# Altium schematic sheet FB.SchDoc
size A4; SheetNumber: 2; SheetTotal: 3
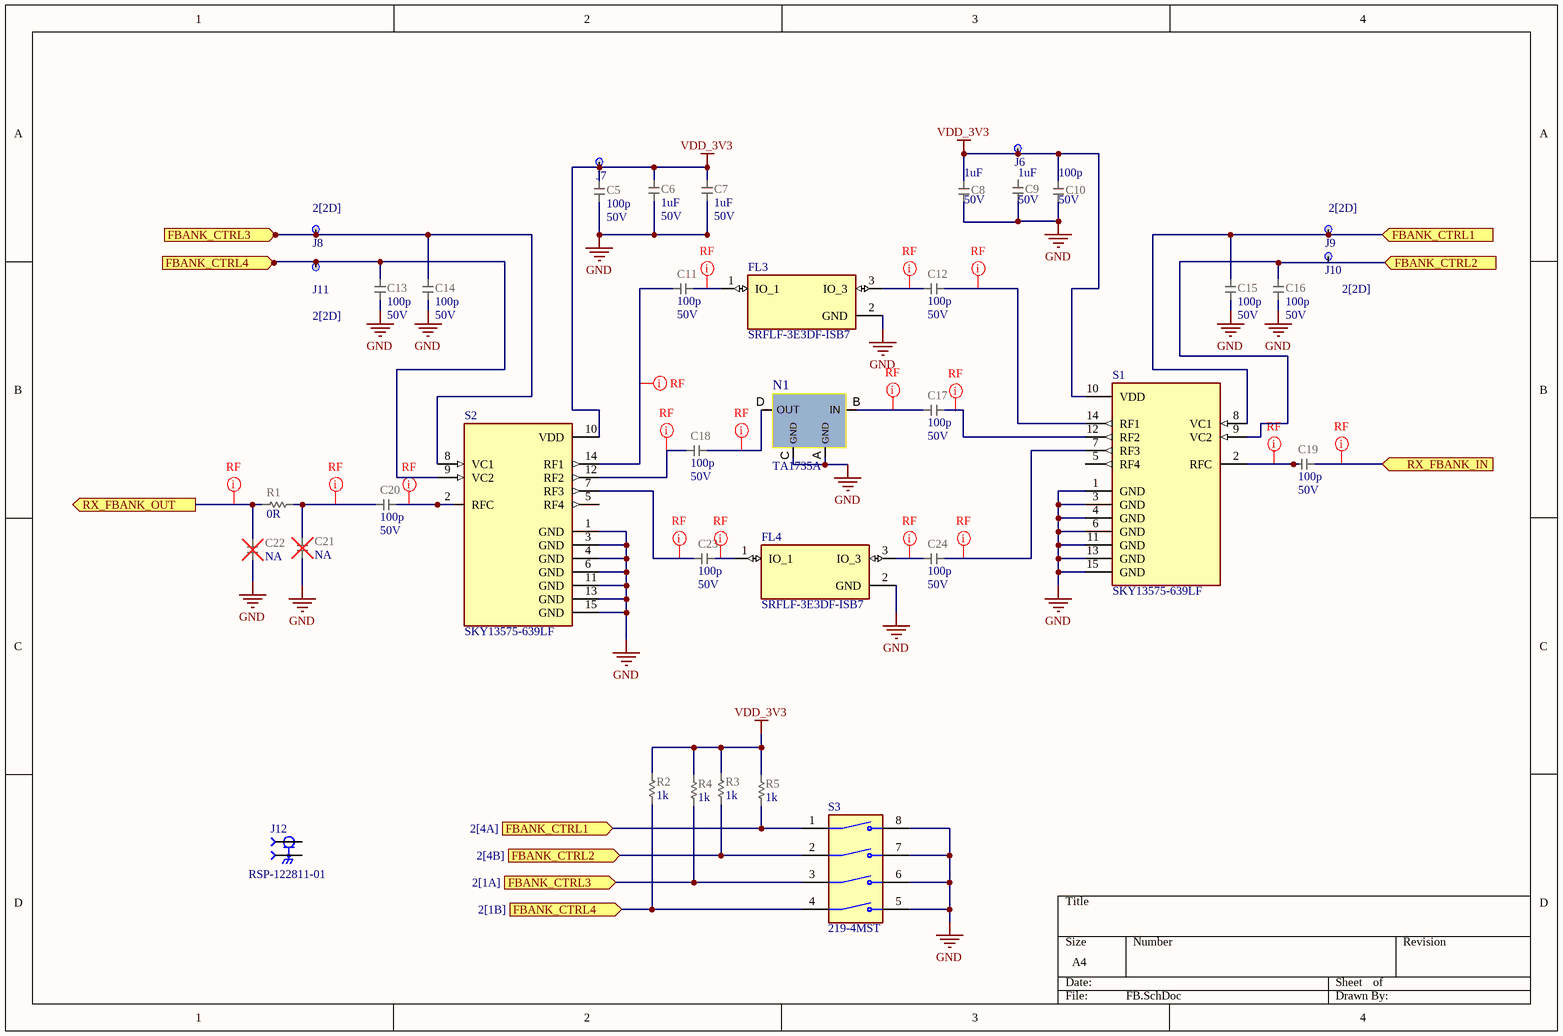
[diagram p0: FB.SchDoc]

## Parts
C5  value 100p  Voltage: 50V  [CAP_0603_UN1Q]  (hidden comment: CAP_0603_100p)
C6  value 1uF  Voltage: 50V  [CAP_0603_UN1Q]  (hidden comment: CAP_0603_1u_X7R)
C7  value 1uF  Voltage: 50V  [CAP_0603_UN1Q]  (hidden comment: CAP_0603_1u_X7R)
C8  value 1uF  Voltage: 50V  [CAP_0603_UN1Q]  (hidden comment: CAP_0603_1u_X7R)
C9  value 1uF  Voltage: 50V  [CAP_0603_UN1Q]  (hidden comment: CAP_0603_1u_X7R)
C10  value 100p  Voltage: 50V  [CAP_0603_UN1Q]  (hidden comment: CAP_0603_100p)
C11  value 100p  Voltage: 50V  [CAP_0603_UN1Q]  (hidden comment: CAP_0603_100p)
C12  value 100p  Voltage: 50V  [CAP_0603_UN1Q]  (hidden comment: CAP_0603_100p)
C13  value 100p  Voltage: 50V  [CAP_0603_UN1Q]  (hidden comment: CAP_0603_100p)
C14  value 100p  Voltage: 50V  [CAP_0603_UN1Q]  (hidden comment: CAP_0603_100p)
C15  value 100p  Voltage: 50V  [CAP_0603_UN1Q]  (hidden comment: CAP_0603_100p)
C16  value 100p  Voltage: 50V  [CAP_0603_UN1Q]  (hidden comment: CAP_0603_100p)
C17  value 100p  Voltage: 50V  [CAP_0603_UN1Q]  (hidden comment: CAP_0603_100p)
C18  value 100p  Voltage: 50V  [CAP_0603_UN1Q]  (hidden comment: CAP_0603_100p)
C19  value 100p  Voltage: 50V  [CAP_0603_UN1Q]  (hidden comment: CAP_0603_100p)
C20  value 100p  Voltage: 50V  [CAP_0603_UN1Q]  (hidden comment: CAP_0603_100p)
C21  value NA  [CAP_0603_UN1Q]  (hidden comment: CAP_0603_NA)
C22  value NA  [CAP_0603_UN1Q]  (hidden comment: CAP_0603_NA)
C23  value 100p  Voltage: 50V  [CAP_0603_UN1Q]  (hidden comment: CAP_0603_100p)
C24  value 100p  Voltage: 50V  [CAP_0603_UN1Q]  (hidden comment: CAP_0603_100p)
FL3  SRFLF-3E3DF-ISB7  [FIL_SRFLF-3E3DF-ISB7]
FL4  SRFLF-3E3DF-ISB7  [FIL_SRFLF-3E3DF-ISB7]
J6  Testpoint, Surface, 1.0mm  [TP_1mm_UN1Q]  (value not drawn)  (no BOM)
J7  Testpoint, Surface, 1.0mm  [TP_1mm_UN1Q]  (value not drawn)  (no BOM)
J8  Testpoint, Surface, 1.0mm  [TP_1mm_UN1Q]  (value not drawn)  (no BOM)
J9  Testpoint, Surface, 1.0mm  [TP_1mm_UN1Q]  (value not drawn)  (no BOM)
J10  Testpoint, Surface, 1.0mm  [TP_1mm_UN1Q]  (value not drawn)  (no BOM)
J11  Testpoint, Surface, 1.0mm  [TP_1mm_UN1Q]  (value not drawn)  (no BOM)
J12  RSP-122811-01  [SAMTEC_RSP-122811-01]
N1  TA1735A  [TA1735A_SM2016-4]
R1  value 0R  [RES_0603_UN1Q]  (hidden comment: RES_0603_0R)
R2  value 1k  [RES_0603_UN1Q]  (hidden comment: RES_0603_1k)
R3  value 1k  [RES_0603_UN1Q]  (hidden comment: RES_0603_1k)
R4  value 1k  [RES_0603_UN1Q]  (hidden comment: RES_0603_1k)
R5  value 1k  [RES_0603_UN1Q]  (hidden comment: RES_0603_1k)
S1  SKY13575-639LF  [SW_SKY13575-639LF]
S2  SKY13575-639LF  [SW_SKY13575-639LF]
S3  219-4MST  [SW_219-4MST]

## Ports
FBANK_CTRL1 (in, see 2[2D]), FBANK_CTRL1 (in, see 2[4A]), FBANK_CTRL2 (in, see 2[2D]), FBANK_CTRL2 (in, see 2[4B]), FBANK_CTRL3 (in, see 2[1A]), FBANK_CTRL3 (in, see 2[2D]), FBANK_CTRL4 (in, see 2[1B]), FBANK_CTRL4 (in, see 2[2D]), RX_FBANK_IN (in), RX_FBANK_OUT (out)

## Nets
GND: C5.2 C6.1 C7.1 C8.1 C9.1 C10.2 C13.2 C14.2 C15.2 C16.2 C21.1 C22.1 FL3.2(GND) FL4.2(GND) N1.A(GND) N1.C(GND) S1.1(GND) S1.3(GND) S1.4(GND) S1.6(GND) S1.11(GND) S1.13(GND) S1.15(GND) S2.1(GND) S2.3(GND) S2.4(GND) S2.6(GND) S2.11(GND) S2.13(GND) S2.15(GND) S3.5 S3.6 S3.7 S3.8
VDD_3V3: C5.1 C6.2 C7.2 C8.2 C10.1 J6.1(TP) J7.1(TP) R2.2 R3.2 R4.2 R5.2 S1.10(VDD) S2.10(VDD)
FBANK_CTRL1: C15.1 J9.1(TP) R5.1 S1.8(VC1) S3.1 ; port FBANK_CTRL1
FBANK_CTRL2: C16.1 R3.1 S1.9(VC2) S3.2 ; port FBANK_CTRL2
FBANK_CTRL3: C14.1 J8.1(TP) R4.1 S2.8(VC1) S3.3 ; port FBANK_CTRL3
FBANK_CTRL4: C13.1 J11.1(TP) R2.1 S2.9(VC2) S3.4 ; port FBANK_CTRL4
RX_FBANK_IN: C19.1 ; port RX_FBANK_IN
RX_FBANK_OUT: C22.2 R1.1 ; port RX_FBANK_OUT
NetC11_1: C11.1 FL3.1(IO_1)
NetC11_2: C11.2 S2.14(RF1)
NetC12_1: C12.1 S1.14(RF1)
NetC12_2: C12.2 FL3.3(IO_3)
NetC17_1: C17.1 S1.12(RF2)
NetC17_2: C17.2 N1.B(IN)
NetC18_1: C18.1 N1.D(OUT)
NetC18_2: C18.2 S2.12(RF2)
NetC19_2: C19.2 S1.2(RFC)
NetC20_1: C20.1 S2.2(RFC)
NetC20_2: C20.2 C21.2 R1.2
NetC23_1: C23.1 FL4.1(IO_1)
NetC23_2: C23.2 S2.7(RF3)
NetC24_1: C24.1 S1.7(RF3)
NetC24_2: C24.2 FL4.3(IO_3)
NetJ12_G1: J12.G1(GND) J12.G2(GND)

Not connected (* = marked no-connect by the designer): C9 2; J10 1(TP); J12 1; S1 5(RF4); S2 5(RF4)

## Layout directives
net class RF: (no net found under the mark), NetC11_1, NetC11_2, NetC12_1, NetC12_2, NetC17_2, NetC18_1, NetC18_2, NetC19_2, NetC20_1, NetC20_2, NetC23_1, NetC23_2, NetC24_1, NetC24_2, RX_FBANK_IN, RX_FBANK_OUT

## Library data of the parts
C5 C10-C20 C23 C24 = CMP-001-000378-11: CAP; Manufacturer: Murata; Part Number: GCM188R71H102KA37J; Temperature characteristics: X7R; HasBeenBuilt: TBD; System: RLC; Alternative component: Allowed; Sort order: 306; Tolerance: +/-10%; Creation date: 20210927; Package: 0603; ComponentLink4Description: 4_X-information; ComponentLink2Description: 2_Product page; ECCN: EAR99; RoHS: RoHS3; Operating temperature range: -55 ... +125°C; ComponentLink3Description: 3_X-information; Source: RLC_UN1Q.SchLib; ComponentLink1Description: 1_Datasheet; Manufacturer Part Number: GCM188R71H102KA37J; Component Type: Capacitor
C6-C9 = CMP-001-000333-14: CAP; Part Number: UMK107AB7105KA-T; Manufacturer: Taiyo Yuden; Tolerance: +/-20%; Sort order: 306; HasBeenBuilt: TBD; Alternative component: Allowed; Temperature characteristics: X7R; System: RLC; Package: 0603; ComponentLink1Description: 1_Datasheet; ComponentLink2Description: 2_Product page; ComponentLink3Description: 3_X-information; ComponentLink4Description: 4_X-information; Creation date: 20210917; Source: RLC_UN1Q.SchLib; Manufacturer Part Number: UMK107AB7105KA-T; Component Type: Capacitor
C21 C22 = CMP-001-000259-10: Not Assembled - CAP; Sort order: 999; System: RLC; HasBeenBuilt: TBD; Creation date: 20190101; Package: 0603; Source: RLC_UN1Q.SchLib; ComponentLink3Description: 3_X-information; ComponentLink1Description: 1_Datasheet; ComponentLink2Description: 2_Product page; ComponentLink4Description: 4_X-information; Component Type: Capacitor
FL3 FL4 = SRFLF-3E3DF-ISB7: 3.4mm x 3.3mm SMD ISM 915MHz Low Pass Filter; MF: Suntsu Electronics, Inc; SnapEDA_Link: https://www.snapeda.com/parts/SRFLF-3E3DF-ISB7/Suntsu/view-part/?ref=snap; Package: None; Value: *; MP: SRFLF-3E3DF-ISB7; Check_prices: https://www.snapeda.com/parts/SRFLF-3E3DF-ISB7/Suntsu/view-part/?ref=eda
J6-J11 = CMP-001-000153-12: Testpoint 1.0mm; Part Number: TP 1mm; Sort order: -; HasBeenBuilt: -; ClassName: SMALL; ComponentLink1Description: 1_Datasheet; ComponentLink2Description: 2_Product page; ComponentLink3Description: 3_X-information; ComponentLink4Description: 4_X-information; Creation date: 20200101; System: Test Point; Design Item ID: TP_1mm; Source: Conn_UN1Q.SchLib; Component Type: Test Point
J12 = RSP-122811-01: MF: {'manufacturer': u'Samtec Inc.'}; Package: None; Price: None; Value: *; MP: RSP-122811-01; Availability: Unavailable
N1 = CMP-001-001528-1: 867.5 MHz SAW Filter, IL 3.5 dB, 15 MHz BW; Manufacturer: TAI-SAW; Manufacturer: TST - Tamsan; Sort order: 701; System: RF; Part Number: TA1735A; Operating temperature range: -30 to +80 °C; Package: SM2016-4; Dimensions WxLxH: 1.6 x 2 x 0.90 mm; ComponentLink1Description: 1_Datasheet; ComponentLink1URL: https://www.taisaw.com/assets/PDF/TA1735A%20_Rev.1.0_.pdf; Creation date: 20250828; ECCN: EAR99; ComponentLink2Description: 2_Product page; ComponentLink3Description: 3_X-information; ComponentLink4Description: 4_X-information; RoHS: RoHS 3; Manufacturer Part Number: TA1735A; Component Type: RF Discrete
R1 = CMP-001-000441-13: RES; Manufacturer: YAGEO; Part Number: RC0603FR-070RL; Alternative component: Allowed; HasBeenBuilt: TBD; Tolerance: 5%; Sort order: 326; Power Rating: 1/10W; System: RLC; ComponentLink2Description: 2_Product page; Source: RLC_UN1Q.SchLib; ComponentLink3Description: 3_X-information; ComponentLink1Description: 1_Datasheet; Package: 0603; Creation date: 20190101; ComponentLink4Description: 4_X-information; Component Type: Resistor
R2-R5 = CMP-001-000441-13: RES; Manufacturer: YAGEO; Alternative component: Allowed; HasBeenBuilt: TBD; Tolerance: 5%; Sort order: 326; Power Rating: 1/10W; System: RLC; ComponentLink2Description: 2_Product page; Source: RLC_UN1Q.SchLib; ComponentLink3Description: 3_X-information; ComponentLink1Description: 1_Datasheet; Package: 0603; Creation date: 20190101; ComponentLink4Description: 4_X-information; Component Type: Resistor
S1 S2 = SKY13575-639LF: RF Switch IC 802.11a/b/g/n/ac SP4T 6 GHz 50Ohm 14-QFN (1.6x1.6); MF: Skyworks Solutions; SnapEDA_Link: https://www.snapeda.com/parts/SKY13575-639LF/Skyworks+Solution%252C+Inc./view-part/?ref=snap; Package: QFN-14 Skyworks Solutions; Value: *; MP: SKY13575-639LF; Check_prices: https://www.snapeda.com/parts/SKY13575-639LF/Skyworks+Solution%252C+Inc./view-part/?ref=eda
S3 = 219-4MST: Dip Switch SPST 4 Position Surface Mount Slide (Standard) Actuator 100mA 20VDC; MF: CTS Electronic Components; SnapEDA_Link: https://www.snapeda.com/parts/219-4MST/CTS+Components/view-part/?ref=snap; Package: None; Value: *; MP: 219-4MST; Check_prices: https://www.snapeda.com/parts/219-4MST/CTS+Components/view-part/?ref=eda